# EAGLE design IOIO - VRM (EAGLE 5.11)
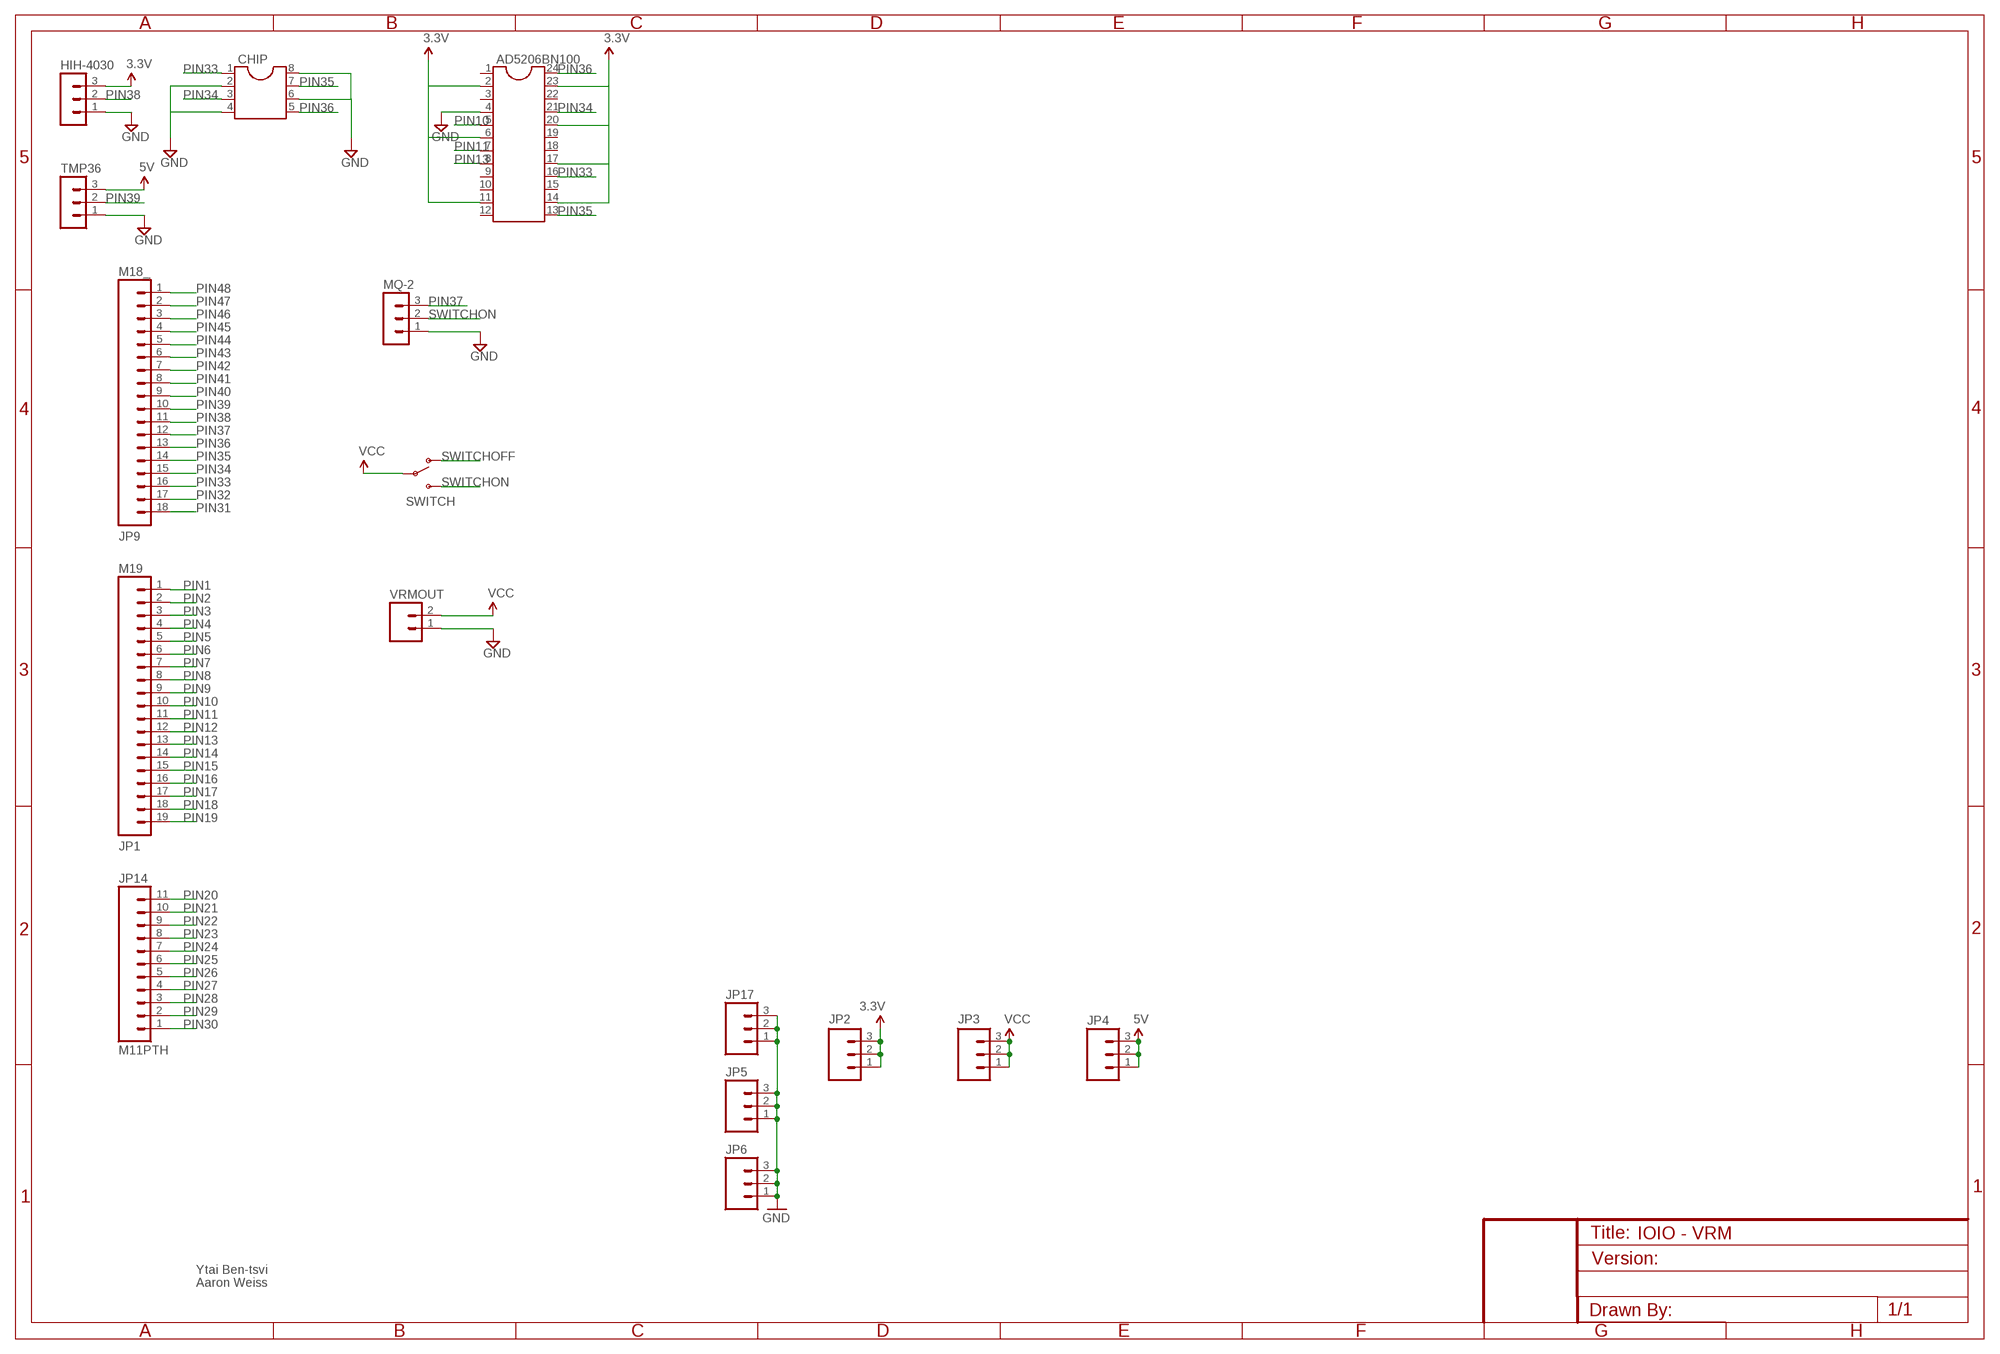
[diagram p0: schematic, sheet 1]

## Parts
AD5206BN100  DIL24-3  [DIL24-3]
CHIP  DIL8S  [SOCKET-08]
HIH-4030  MA03-1  [MA03-1]
JP1  M19  [1X19]
JP2  M03PTH  [1X03]
JP3  M03PTH  [1X03]
JP4  M03PTH  [1X03]
JP5  M03PTH  [1X03]
JP6  M03PTH  [1X03]
JP9  M18_  [1X18]
JP14  M11PTH  [1X11]
JP17  M03PTH  [1X03]
MQ-2  MA03-1  [MA03-1]
SWITCH  SWITCH-SPSTPTH_LOCK  [SWITCH-SPDT_LOCK.007S]
TMP36  MA03-1  [MA03-1]
VRMOUT  M02LOCK  [1X02_LOCK]

## Nets
3.3V: AD5206BN100.2 AD5206BN100.6 AD5206BN100.11 AD5206BN100.14 AD5206BN100.17 AD5206BN100.20 AD5206BN100.23 HIH-4030.3 JP2.1 JP2.2 JP2.3
5V: JP4.1 JP4.2 JP4.3 TMP36.3
GND: AD5206BN100.4 CHIP.2 CHIP.4 CHIP.6 CHIP.8 HIH-4030.1 JP5.1 JP5.2 JP5.3 JP6.1 JP6.2 JP6.3 JP17.1 JP17.2 JP17.3 MQ-2.1 TMP36.1 VRMOUT.1
PIN1: JP1.1
PIN2: JP1.2
PIN3: JP1.3
PIN4: JP1.4
PIN5: JP1.5
PIN6: JP1.6
PIN7: JP1.7
PIN8: JP1.8
PIN9: JP1.9
PIN10: AD5206BN100.5 JP1.10
PIN11: AD5206BN100.7 JP1.11
PIN12: JP1.12
PIN13: AD5206BN100.8 JP1.13
PIN14: JP1.14
PIN15: JP1.15
PIN16: JP1.16
PIN17: JP1.17
PIN18: JP1.18
PIN19: JP1.19
PIN20: JP14.11
PIN21: JP14.10
PIN22: JP14.9
PIN23: JP14.8
PIN24: JP14.7
PIN25: JP14.6
PIN26: JP14.5
PIN27: JP14.4
PIN28: JP14.3
PIN29: JP14.2
PIN30: JP14.1
PIN31: JP9.18
PIN32: JP9.17
PIN33: AD5206BN100.16 CHIP.1 JP9.16
PIN34: AD5206BN100.21 CHIP.3 JP9.15
PIN35: AD5206BN100.13 CHIP.7 JP9.14
PIN36: AD5206BN100.24 CHIP.5 JP9.13
PIN37: JP9.12 MQ-2.3
PIN38: HIH-4030.2 JP9.11
PIN39: JP9.10 TMP36.2
PIN40: JP9.9
PIN41: JP9.8
PIN42: JP9.7
PIN43: JP9.6
PIN44: JP9.5
PIN45: JP9.4
PIN46: JP9.3
PIN47: JP9.2
PIN48: JP9.1
SWITCHOFF: SWITCH.1(O)
SWITCHON: MQ-2.2 SWITCH.3(S)
VCC: JP3.1 JP3.2 JP3.3 SWITCH.2(P) VRMOUT.2
Unconnected: AD5206BN100.1 AD5206BN100.3 AD5206BN100.9 AD5206BN100.10 AD5206BN100.12 AD5206BN100.15 AD5206BN100.18 AD5206BN100.19 AD5206BN100.22

## Notes on the sheet
- Ytai Ben-tsvi
- Aaron Weiss

## Library data of the parts
AD5206BN100 = ic-package:DIL24: Dual In Line
CHIP = ic-package:DIL8: Dual In Line / Socket
HIH-4030 MQ-2 TMP36 = con-lstb:MA03-1: PIN HEADER; OC_FARNELL: unknown; OC_NEWARK: unknown
JP1 = SparkFun:M19
JP2-JP6 JP17 = SparkFun:M03: Header 3 Standard 3-pin 0.1" header. Use with straight break away headers (SKU : PRT-00116), right angle break away headers (PRT-00553), swiss pins (PRT-00743), machine pins (PRT-00117), and female headers (PRT-00115). Molex polarized connector foot print use with SKU : PRT-08232 with associated crimp pins and housings.
JP9 = SparkFun:M18
JP14 = SparkFun:M11: Header 11 Standard 11-pin 0.1" header. Use with straight break away headers (SKU : PRT-00116), right angle break away headers (PRT-00553), swiss pins (PRT-00743), machine pins (PRT-00117), and female headers (PRT-00115).
SWITCH = SparkFun:SWITCH-SPST: SPST Switch Simple slide switch. Spark Fun Electronics SKU : COM-00102
VRMOUT = SparkFun:M02: Header 2 Standard 2-pin 0.1" header. Use with straight break away headers (SKU : PRT-00116), right angle break away headers (PRT-00553), swiss pins (PRT-00743), machine pins (PRT-00117), and female headers (PRT-00115). Molex polarized connector foot print use with SKU : PRT-08233 with associated crimp pins and housings.

## Board
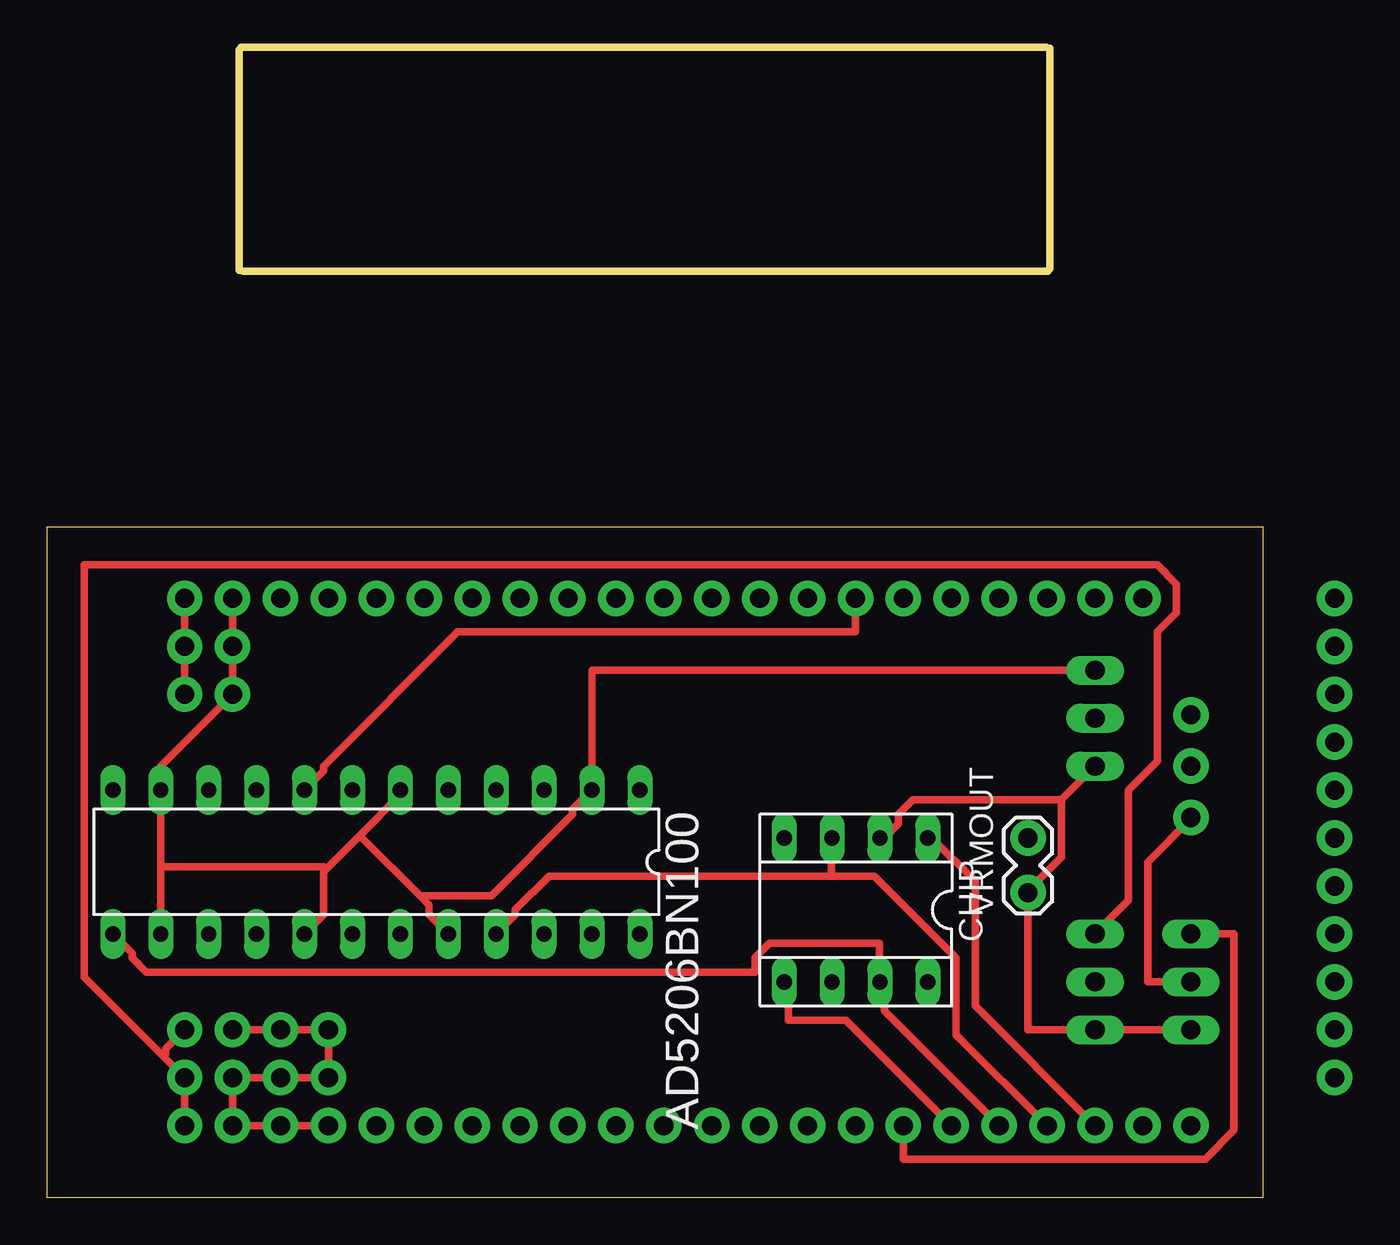
[diagram p1: board, top side]
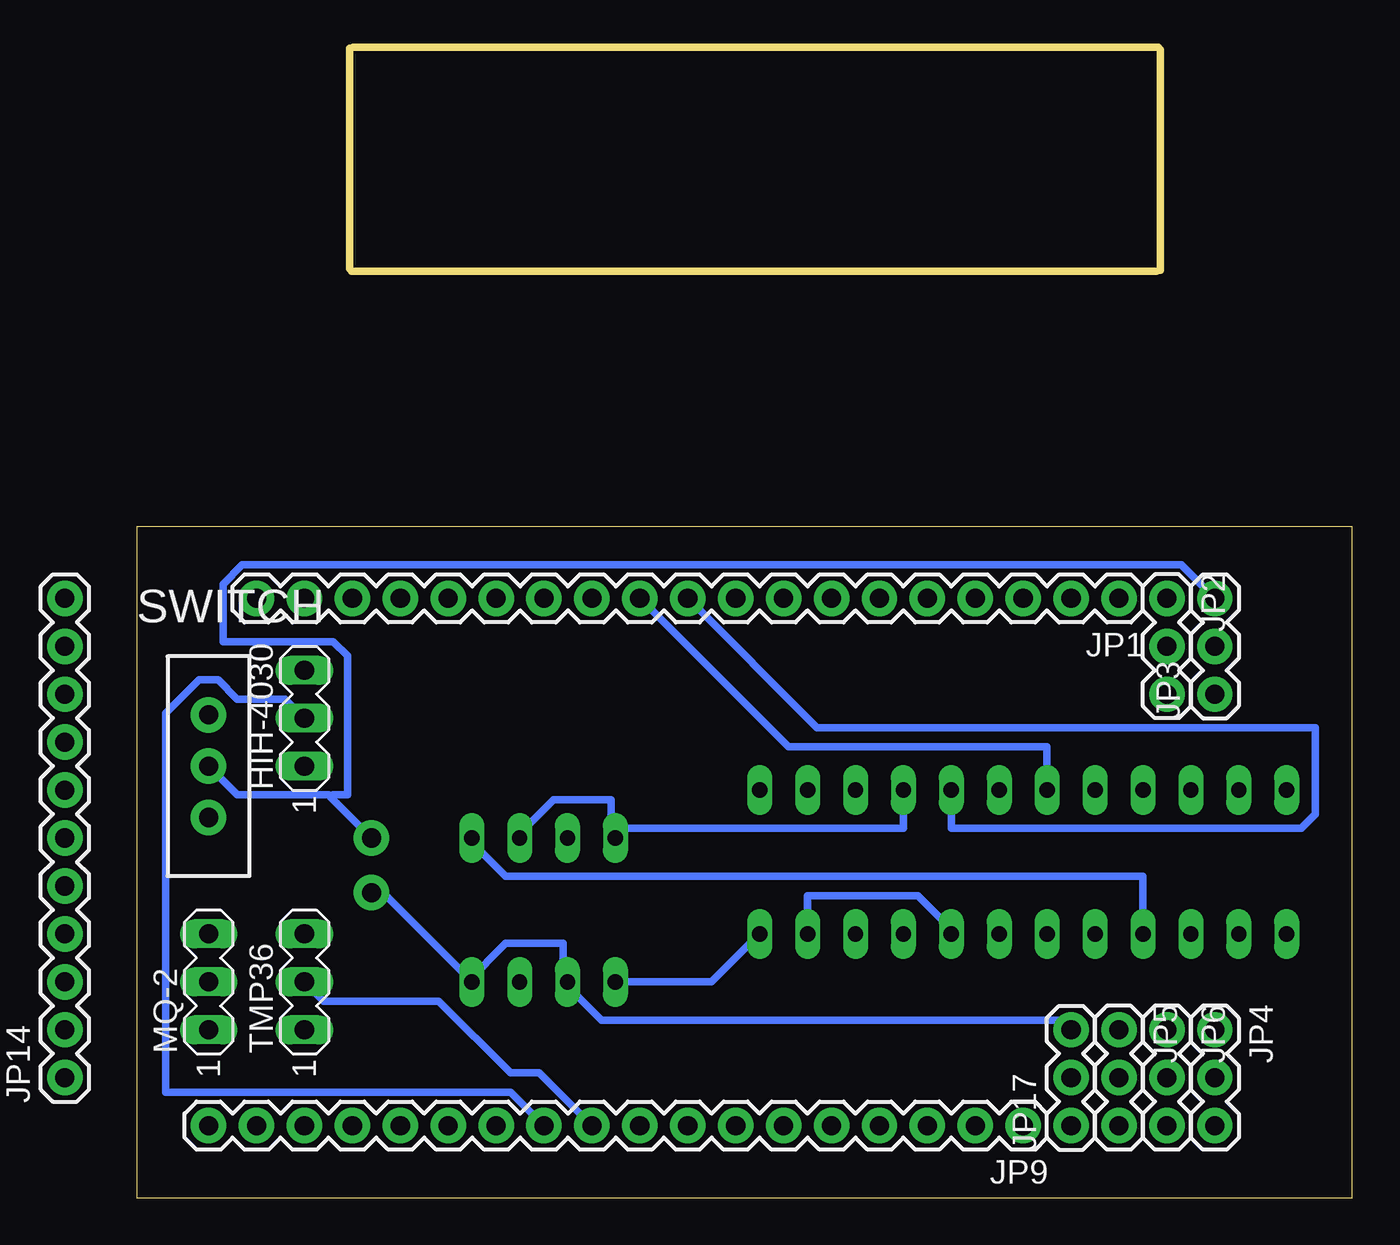
[diagram p2: board, bottom side, seen from below]

Size 64.44 x 60.96 mm. Coordinates in mm from the lower left corner, seen from the top.
Outline: 10.29,60.96 52.96,60.96
Outline: 10.19,60.83 10.19,49.15
Outline: 53.06,49.1 10.39,49.1
Outline: 53.16,49.23 53.16,60.91
Outline: 64.44,0 0,0 0,35.55 64.44,35.55 64.44,0
Copper layers (1*16): Top 0.035mm / dielectric 1.5mm / Bottom 0.035mm
Design rules "default *": minimum track width 16mil, minimum drill 24mil, track to track 20mil, track to pad 20mil, pad to pad 20mil, via to via 20mil, smd to smd 20mil, copper to edge 40mil, drill to drill 8mil, minimum pad ring 10mil, minimum via ring 8mil, stop-mask expansion 4mil, vias tented up to drill 0mil, thermal gap 10mil

### Footprints (pad centres in the part's own frame; a part is rotated, then mirrored left to right if it is on the bottom)
DIL24-3 = drill 0.813 long: 1 -13.97,-3.81; 2 -11.43,-3.81; 3 -8.89,-3.81; 4 -6.35,-3.81; 5 -3.81,-3.81; 6 -1.27,-3.81; 7 1.27,-3.81; 8 3.81,-3.81; 9 6.35,-3.81; 10 8.89,-3.81; 11 11.43,-3.81; 12 13.97,-3.81; 13 13.97,3.81; 14 11.43,3.81; 15 8.89,3.81; 16 6.35,3.81; 17 3.81,3.81; 18 1.27,3.81; 19 -1.27,3.81; 20 -3.81,3.81; 21 -6.35,3.81; 22 -8.89,3.81; 23 -11.43,3.81; 24 -13.97,3.81
SOCKET-08 = drill 0.813 long: 1 -3.81,-3.81; 2 -1.27,-3.81; 3 1.27,-3.81; 4 3.81,-3.81; 5 3.81,3.81; 6 1.27,3.81; 7 -1.27,3.81; 8 -3.81,3.81
MA03-1 = drill 1.016 long: 1 -2.54,0; 2 0,0; 3 2.54,0
1X19 = drill 1.016 pad 1.88 round: 1 0,0; 2 2.54,0; 3 5.08,0; 4 7.62,0; 5 10.16,0; 6 12.7,0; 7 15.24,0; 8 17.78,0; 9 20.32,0; 10 22.86,0; 11 25.4,0; 12 27.94,0; 13 30.48,0; 14 33.02,0; 15 35.56,0; 16 38.1,0; 17 40.64,0; 18 43.18,0; 19 45.72,0
1X03 = drill 1.016 pad 1.88 round: 1 0,0; 2 2.54,0; 3 5.08,0
1X18 = drill 1.016 pad 1.88 round: 1 0,0; 2 2.54,0; 3 5.08,0; 4 7.62,0; 5 10.16,0; 6 12.7,0; 7 15.24,0; 8 17.78,0; 9 20.32,0; 10 22.86,0; 11 25.4,0; 12 27.94,0; 13 30.48,0; 14 33.02,0; 15 35.56,0; 16 38.1,0; 17 40.64,0; 18 43.18,0
1X11 = drill 1.016 pad 1.88 round: 1 0,0; 2 2.54,0; 3 5.08,0; 4 7.62,0; 5 10.16,0; 6 12.7,0; 7 15.24,0; 8 17.78,0; 9 20.32,0; 10 22.86,0; 11 25.4,0
SWITCH-SPDT_LOCK.007S = drill 1.016 pad 1.88 round: 1 0,2.718; 2 0,0; 3 0,-2.718
1X02_LOCK = drill 1.016 pad 1.88 round: 1 -0.178,0; 2 2.718,0

### Placement (x,y rotation side)
AD5206BN100  17.45,17.78 180 top
CHIP  42.88,15.24 180 top
HIH-4030  55.55,25.4 90 bottom
JP1  12.37,31.75 180 bottom
JP2  9.83,31.75 270 bottom
JP3  7.29,26.67 90 bottom
JP4  7.29,8.89 270 bottom
JP5  12.37,8.89 270 bottom
JP6  9.83,8.89 270 bottom
JP9  17.45,3.81 180 bottom
JP14  68.25,6.35 90 bottom  (outside the outline)
JP17  14.91,3.81 90 bottom
MQ-2  60.63,11.43 90 bottom
SWITCH  60.63,22.86 0 bottom
TMP36  55.55,11.43 90 bottom
VRMOUT  51.99,16.33 90 top

### Tracks (layer width: path | path; a pad name or v marks a point on that pad's centre or on a via)
3.3V
  Top 0.406: JP2.1 JP2.2 JP2.3 6.02,22.86 AD5206BN100.11 6.02,17.53 | AD5206BN100.14 6.02,17.53 | AD5206BN100.17 14.66,14.99 14.66,17.27 14.78,17.4 | 16.56,19.18 18.72,21.34 AD5206BN100.6 | 14.78,17.4 16.56,19.18 | AD5206BN100.20 20.24,14.99 20.24,15.49 19.86,15.88 | 16.56,19.18 19.86,15.88 | 19.86,15.88 19.99,16 23.55,16 27.86,20.32 27.86,20.57 AD5206BN100.2 28.88,27.94 HIH-4030.3 | 6.02,17.53 14.66,17.53 14.78,17.4
  Bottom 0.406: AD5206BN100.23 28.88,16 23.04,16 21.26,14.22 AD5206BN100.20
5V
  Top 0.406: TMP36.3 57.33,15.75 57.33,21.59 58.85,23.11 58.85,29.97 59.87,30.99 59.87,32.51 58.85,33.53 1.96,33.53 1.96,11.68 6.15,7.49 | 6.15,7.49 JP4.2 JP4.3 | JP4.1 6.27,7.87 6.27,7.62 6.15,7.49
GND
  Top 0.406: JP6.1 JP5.1 JP17.3 JP17.2 JP5.2 JP6.2 JP6.3 JP5.3 JP17.1 | MQ-2.1 TMP36.1 51.99,8.89 VRMOUT.1 51.99,16.26 53.77,18.03 53.77,21.08 | 53.77,21.08 HIH-4030.1 | 53.77,21.08 45.9,21.08 45.14,20.32 45.14,19.81 44.37,19.05 CHIP.2
  Bottom 0.406: 39.29,19.56 39.29,21.08 42.34,21.08 44.37,19.05 CHIP.2 | 39.29,19.56 39.29,19.05 CHIP.4 39.29,19.56 | AD5206BN100.4 23.8,19.56 39.29,19.56 | 41.83,11.43 41.83,13.46 44.88,13.46 46.91,11.43 CHIP.8 46.91,11.68 51.23,16 51.99,16 VRMOUT.1 | JP17.3 15.42,9.4 39.8,9.4 41.83,11.43 | 41.83,11.43 CHIP.6
PIN10
  Bottom 0.406: AD5206BN100.5 21.26,19.56 2.72,19.56 1.96,20.32 1.96,24.89 28.37,24.89 JP1.10
PIN11
  Bottom 0.406: AD5206BN100.7 16.18,23.88 29.9,23.88 JP1.11
PIN13
  Top 0.406: AD5206BN100.8 14.66,22.61 14.66,22.86 21.77,29.97 42.85,29.97 JP1.13
PIN33
  Top 0.406: JP9.16 49.2,10.16 49.2,16.76 46.91,19.05 CHIP.1
  Bottom 0.406: AD5206BN100.16 11.1,17.02 44.88,17.02 46.91,19.05 CHIP.1
PIN34
  Top 0.406: AD5206BN100.21 24.82,14.99 24.82,15.24 26.59,17.02 41.58,17.02 | 41.58,17.02 41.58,19.05 CHIP.3 | JP9.15 48.18,8.64 48.18,12.7 43.87,17.02 41.58,17.02
PIN35
  Top 0.406: AD5206BN100.13 4.5,12.95 4.5,12.7 5.26,11.94 37.52,11.94 37.52,12.7 38.28,13.46 44.12,13.46 44.12,11.43 CHIP.7 44.37,11.43 44.37,9.91 JP9.14
PIN36
  Top 0.406: JP9.13 42.34,9.4 39.29,9.4 39.29,11.43 CHIP.5
  Bottom 0.406: AD5206BN100.24 33.96,11.43 CHIP.5
PIN37
  Top 0.406: MQ-2.3 62.92,13.97 62.92,3.56 61.39,2.03 45.39,2.03 JP9.12
PIN38
  Bottom 0.406: HIH-4030.2 56.57,26.42 59.11,26.42 60.12,27.43 61.14,27.43 62.92,25.65 62.92,5.59 44.63,5.59 JP9.11
PIN39
  Bottom 0.406: TMP36.2 54.53,10.41 48.44,10.41 44.63,6.6 43.1,6.6 JP9.10
SWITCHON
  Top 0.406: MQ-2.2 58.34,11.43 58.34,17.78 60.63,20.07 SWITCH.3
VCC
  Top 0.406: JP3.1 JP3.2 JP3.3
  Bottom 0.406: 54.15,21.21 54.28,21.34 59.11,21.34 SWITCH.2 | 54.15,21.21 VRMOUT.2 | JP3.3 9.07,33.53 58.85,33.53 59.87,32.51 59.87,29.46 54.03,29.46 53.26,28.7 53.26,21.34 54.03,21.34 54.15,21.21